# EAGLE design DDC118_eval2_rev1E (EAGLE 7.3.0)
Assembly variants: low-on-parts
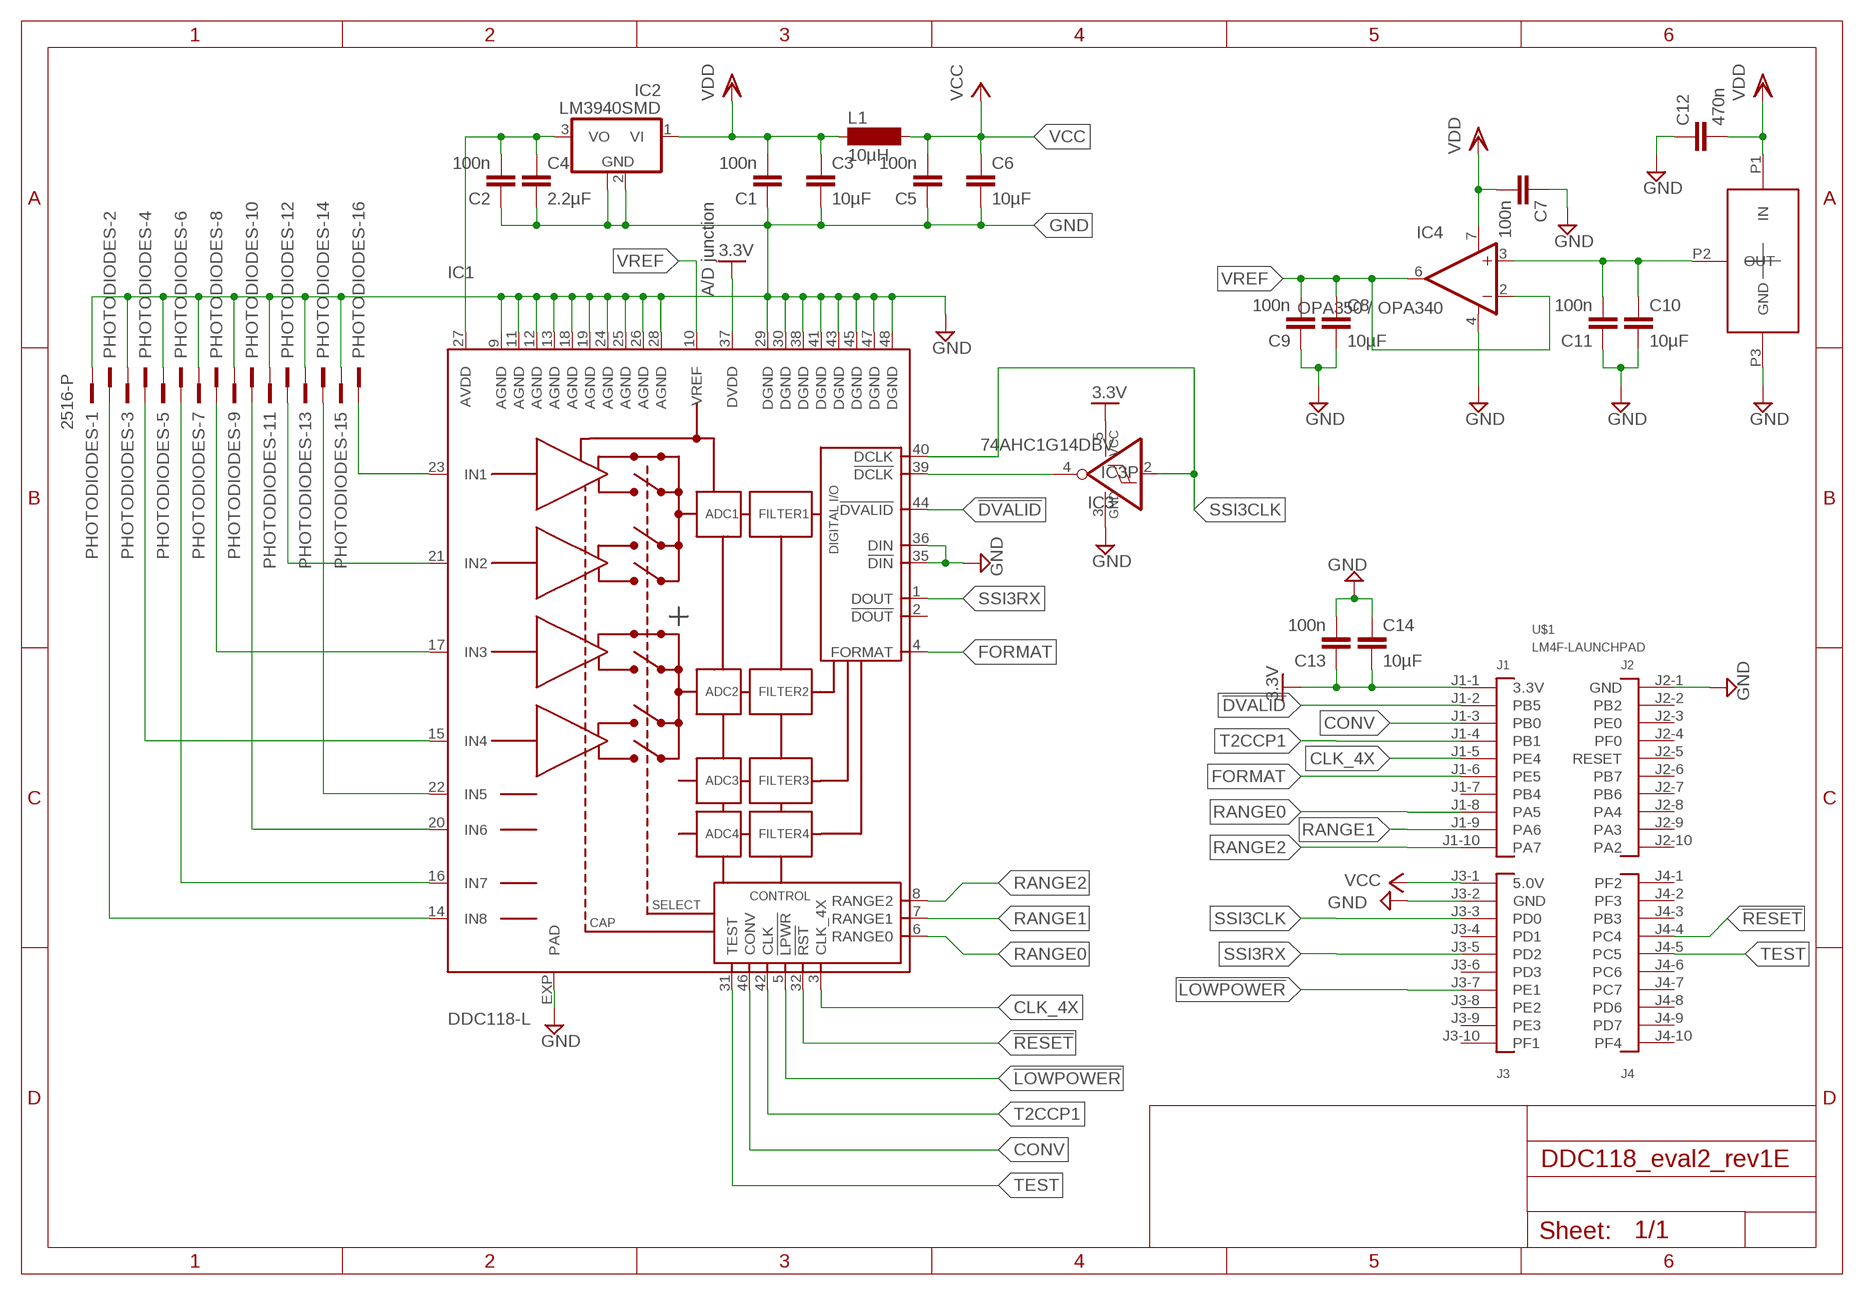
[diagram p0: schematic, sheet 1]

## Parts
C1  100n  C-EUC0805K  [C0805K]  (not fitted in variant low-on-parts)
C2  100n  C-EUC0805K  [C0805K]  (not fitted in variant low-on-parts)
C3  10µF  C-EUC0805  [C0805]
C4  2.2µF  C-EUC0805  [C0805]  (variant low-on-parts: 4µ7)
C5  100n  C-EUC0805K  [C0805K]
C6  10µF  C-EUC0805  [C0805]  (not fitted in variant low-on-parts)
C7  100n  C-EUC0805K  [C0805K]
C8  10µF  C-EUC0805  [C0805]  (variant low-on-parts: 4µ7)
C9  100n  C-EUC0805K  [C0805K]  (not fitted in variant low-on-parts)
C10  10µF  C-EUC0805  [C0805]  (not fitted in variant low-on-parts)
C11  100n  C-EUC0805K  [C0805K]
C12  470n  C-EUC0805K  [C0805K]
C13  100n  C-EUC0805K  [C0805K]  (variant low-on-parts: 470n)
C14  10µF  C-EUC0805  [C0805]  (variant low-on-parts: 4µ7)
IC1  DDC118-L  [VQFN48-L]
IC2  LM3940SMD  [SOT223]
IC3  74AHC1G14DBV  [SOT23-5]
IC4  OPA350 / OPA340  OPA340U  [SO08]
L1  10µH  MS50  [MS50]
PHOTODIODES  2516-P  [PAK100/2500-16-PADS]
U1  REF30XX  [SOT-23]
U$1  LM4F-LAUNCHPAD  [LM4F120-LAUNCHPAD]

## Nets
!DCLK: IC1.39(!DCLK) IC3.4(O)
!DVALID: IC1.44(!DVALID) U$1.J1-2(PB5)
!LOWPOWER: IC1.5(!LPWR) U$1.J3-7(PE1)
!RESET: IC1.32(!RST) U$1.J4-4(PC4)
+3.3V: C13.1 C14.2 IC1.37(DVDD) IC3.5(VCC) U$1.J1-1(3.3V) ; supply symbol labelled 3.3V
AVDD: C2.2 C4.1 IC1.27(AVDD) IC2.3(VO)
CLK_4X: IC1.3(CLK_4X) U$1.J1-5(PE4)
CONV: IC1.46(CONV) U$1.J1-3(PB0)
FORMAT: IC1.4(FORMAT) U$1.J1-6(PE5)
GND: C1.1 C2.1 C3.2 C4.2 C5.1 C6.2 C7.1 C8.2 C9.1 C10.2 C11.1 C12.1 C13.2 C14.1 IC1.9(AGND) IC1.11(AGND) IC1.12(AGND) IC1.13(AGND) IC1.18(AGND) IC1.19(AGND) IC1.24(AGND) IC1.25(AGND) IC1.26(AGND) IC1.28(AGND) IC1.29(DGND) IC1.30(DGND) IC1.35(!DIN) IC1.36(DIN) IC1.38(DGND) IC1.41(DGND) IC1.43(DGND) IC1.45(DGND) IC1.47(DGND) IC1.48(DGND) IC1.EXP(PAD) IC2.2(GND) IC2.4(GND) IC3.3(GND) IC4.4(V-) PHOTODIODES.1 PHOTODIODES.3 PHOTODIODES.5 PHOTODIODES.7 PHOTODIODES.9 PHOTODIODES.11 PHOTODIODES.13 PHOTODIODES.15 U1.P3(GND) U$1.J2-1(GND) U$1.J3-2(GND)
N$2: IC1.21(IN2) PHOTODIODES.12
N$3: IC1.23(IN1) PHOTODIODES.16
N$4: IC1.20(IN6) PHOTODIODES.10
N$5: IC1.17(IN3) PHOTODIODES.8
N$6: IC1.16(IN7) PHOTODIODES.6
N$7: IC1.22(IN5) PHOTODIODES.14
N$8: IC1.15(IN4) PHOTODIODES.4
N$9: IC1.14(IN8) PHOTODIODES.2
N$14: C10.1 C11.2 IC4.3(+IN) U1.P2(OUT)
RANGE0: IC1.6(RANGE0) U$1.J1-8(PA5)
RANGE1: IC1.7(RANGE1) U$1.J1-9(PA6)
RANGE2: IC1.8(RANGE2) U$1.J1-10(PA7)
SSI3CLK: IC1.40(DCLK) IC3.2(I) U$1.J3-3(PD0)
SSI3RX: IC1.1(DOUT) U$1.J3-5(PD2)
T2CCP1: IC1.42(CLK) U$1.J1-4(PB1)
TEST: IC1.31(TEST) U$1.J4-5(PC5)
VCC: C5.2 C6.1 L1.2 U$1.J3-1(5.0V)
VDD: C1.2 C3.1 C7.2 C12.2 IC2.1(VI) IC4.7(V+) L1.1 U1.P1(IN)
VREF: C8.1 C9.2 IC1.10(VREF) IC4.2(-IN) IC4.6(OUT)
Unconnected: IC1.2(!DOUT) U$1.J1-7(PB4) U$1.J2-2(PB2) U$1.J2-3(PE0) U$1.J2-4(PF0) U$1.J2-5(RESET) U$1.J2-6(PB7) U$1.J2-7(PB6) U$1.J2-8(PA4) U$1.J2-9(PA3) U$1.J2-10(PA2) U$1.J3-4(PD1) U$1.J3-6(PD3) U$1.J3-8(PE2) U$1.J3-9(PE3) U$1.J3-10(PF1) U$1.J4-2(PF3) U$1.J4-3(PB3) U$1.J4-6(PC6) U$1.J4-7(PC7) U$1.J4-8(PD6) U$1.J4-9(PD7) U$1.J4-10(PF4)

## Notes on the sheet
- A/D junction

## Power pins joined to a net without a drawn wire
PF2: U$1.J4-1(PF2)

## Library data of the parts
C1-C14 = rcl:C-EU: CAPACITOR, European symbol
IC1 = texas-DAS:DDC118: Octal Current Input, 20-Bit Analog-To-Digital Converter Description: The DDC118 is a 20-bit, octal channel, current-input analog-to-digital (A/D) converter. It combines both current-to-voltage and A/D conversion so that eight low-level current output devices, such as photodiodes, can be directly connected to its inputs and digitized. For each of the eight inputs, the DDC118 provides a dual-switched integrator front-end. This design allows for continuous current integration: while one integrator is being digitized by the onboard A/D converter, the other is integrating the input current. Adjustable full-scale ranges from 12pC to 350pC and adjustable integration times from 50µs to 1s allow currents from fAs to µAs to be measured with outstanding precision. Low-level linearity is ±0.5ppm of the full-scale range and noise is 5.2ppm of the full-scale range. Two modes of operation are provided. In Low-Power mode, total power dissipation is only 13.5mW per channel with a maximum data rate of 2.5kSPS. High-Speed mode supports data rates up to 3.125kSPS with a corresponding dissipation of 18mW per channel. Features: SINGLE-CHIP SOLUTION TO DIRECTLY MEASURE EIGHT LOW-LEVEL CURRENTS HIGH PRECISION, TRUE INTEGRATING FUNCTION INTEGRAL LINEARITY: ±0.01% of Reading ±0.5ppm of FSR VERY LOW NOISE: 5.2ppm of FSR LOW POWER: 13.5mW/channel ADJUSTABLE DATA RATE: Up to 3.125kSPS PROGRAMMABLE FULL SCALE DAISY-CHAINABLE SERIAL INTERFACE Datasheet: http://www.ti.com/lit/ds/symlink/ddc118.pdf Additional information: Basics of operation can be found in the DDC112 datasheet: http://www.ti.com/lit/ds/symlink/ddc112.pdf For practical daisychaining and layout considerations, consider the DDC112 evaluation board documentation: http://www.ti.com/lit/an/sbaa029/sbaa029.pdf
IC2 = custom-parts:LM3940SMD: LM3940 1A Low Dropout Regulator for 5V to 3.3V Conversion http://www.ti.com/lit/ds/symlink/lm3940.pdf The LM3940 is a 1A low dropout regulator designed to provide 3.3V from a 5V supply. The LM3940 is ideally suited for systems which contain both 5V and 3.3V logic, with prime power provided from a 5V bus. Because the LM3940 is a true low dropout regulator, it can hold its 3.3V output in regulation with input voltages as low as 4.5V. The T0-220 package of the LM3940 means that in most ap- plications the full 1A of load current can be delivered without using an additional heatsink. The surface mount TO-263 package uses minimum board space, and gives excellent power dissipation capability when soldered to a copper plane on the PC board.
IC3 = 74xx-little-de:74*1G14: Single Schmitt-Trigger Inverter Gate
IC4 = burr-brown:OPA340: Rail-to-Rail Operational Amplifiers Single-Supply, MicroAmplifier(TM) Series; MPN: OPA340UA; OC_FARNELL: 1106196; OC_NEWARK: 24M5449
L1 = inductor-neosid:MS50: INDUCTOR SMD power inductor; OC_FARNELL: unknown; OC_NEWARK: unknown
PHOTODIODES = custom-conn:2516-: 3M (TM) Pak 100 4-Wall Header 2x8 Pins Source: 3M
U1 = custom-parts:REF30XX: CMOS VOLTAGE REFERENCE: 50ppm/°C, 50µA in SOT23-3 Description: The REF30xx is a precision, low power, low voltage dropout voltage reference family available in a tiny SOT23-3. The REF30xx?s small size and low power consumption (50µA max) make it ideal for portable and battery-powered applications. The REF30xx does not require a load capacitor, but is stable with any capacitive load. Unloaded, the REF30xx can be operated with supplies within 1mV of output voltage. All models are specified for the wide temperature range, ?40°C to +125°C. Features: MicroSIZE PACKAGE: SOT23-3 LOW DROPOUT: 1mV HIGH OUTPUT CURRENT: 25mA LOW TEMPERATURE DRIFT: 50ppm/°C max HIGH ACCURACY: 0.2% LOW IQ: 50µA max Datasheet: http://www.ti.com/lit/ds/sbvs032f/sbvs032f.pdf
U$1 = texas-LM4F-Launchpad:LM4F-LAUNCHPAD: Stellaris® LM4F120 LaunchPad - BoosterPack Footprint Description: The Stellaris® LM4F120 LaunchPad Evaluation Board (EK-LM4F120XL) is a low-cost evaluation platform for ARM® Cortex?-M4F-based microcontrollers. This is the 4x 10 pin main header to which add-on PCBs or mainbaords can connect. Additional Information: http://www.ti.com/lit/ug/spmu289a/spmu289a.pdf

## Net classes
0 default: width 0.15 mm, drill 0.3 mm, clearance 0.15 mm

## Board
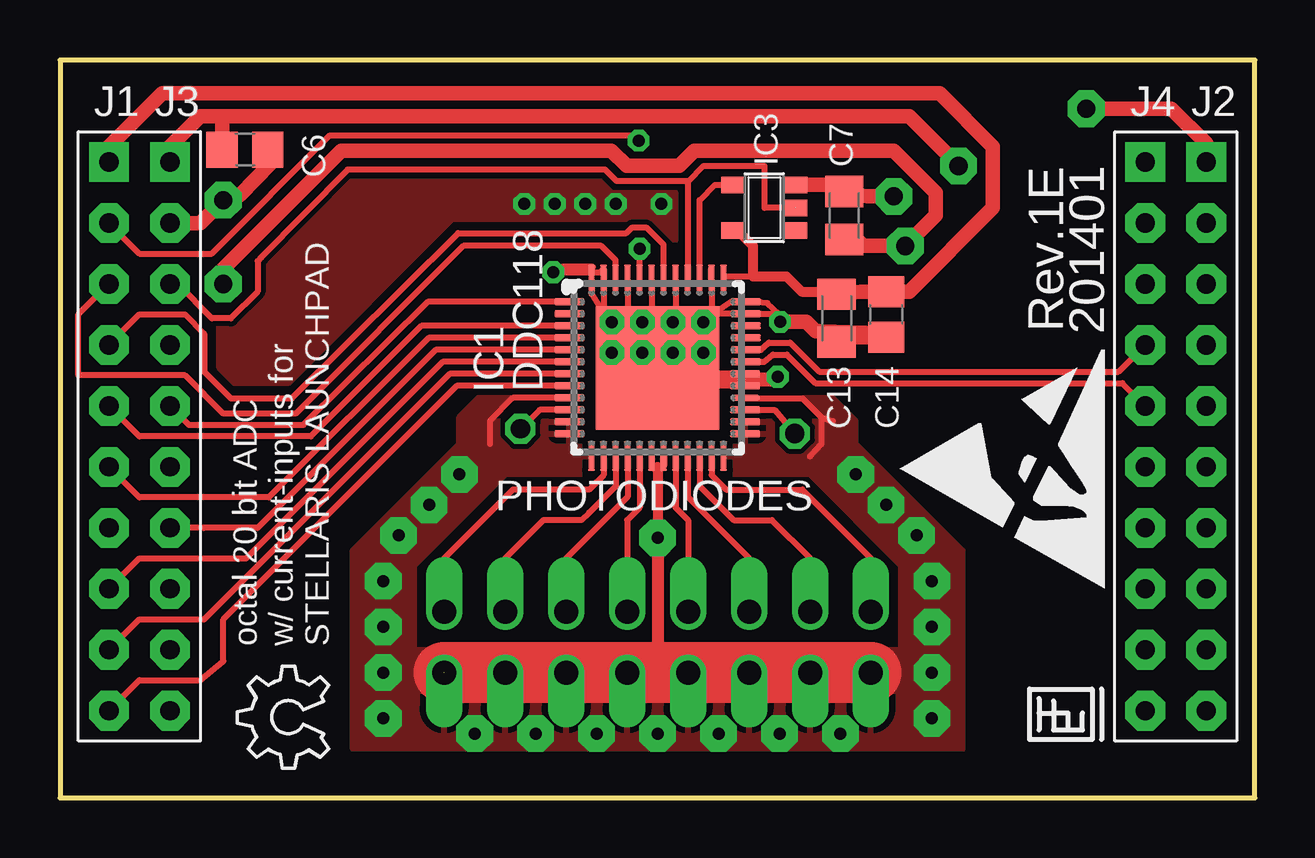
[diagram p1: board, top side]
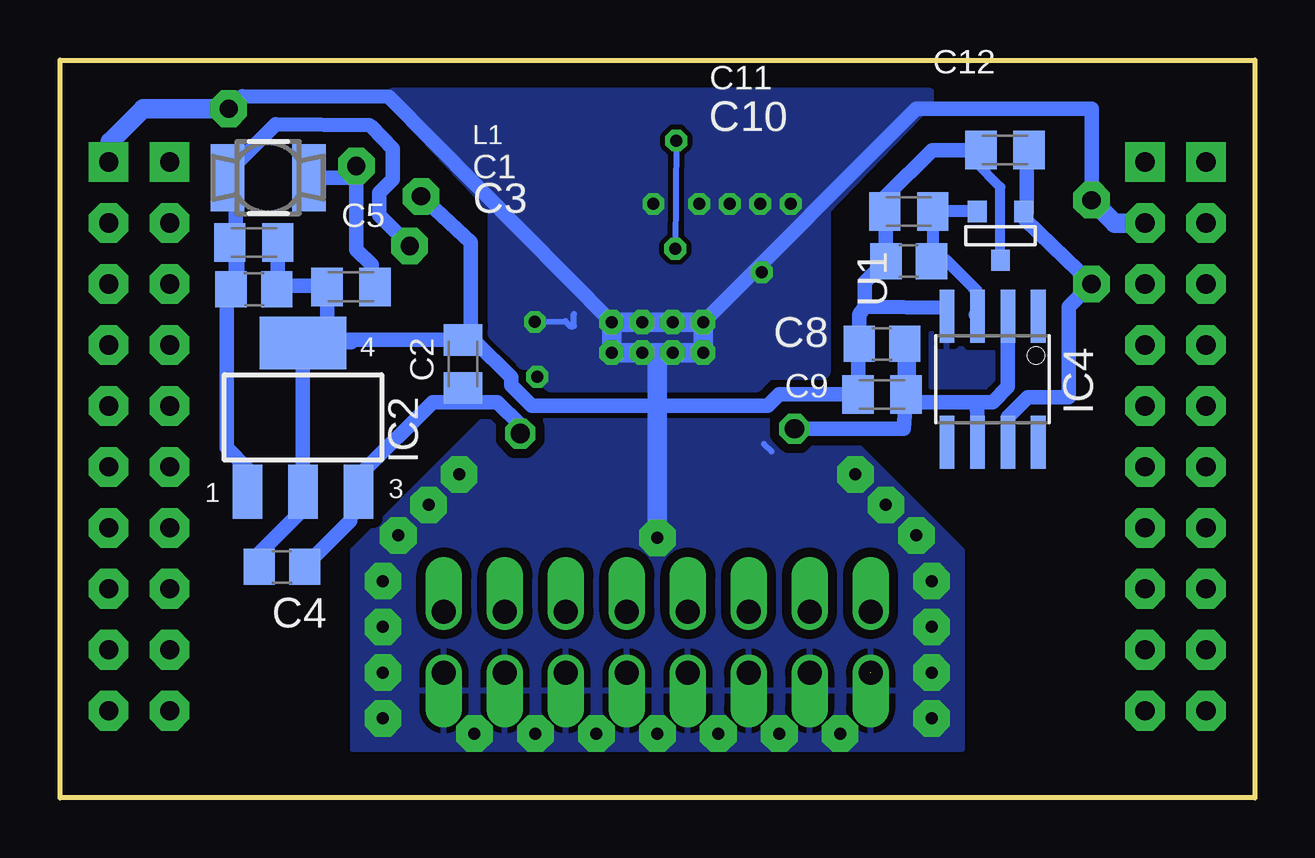
[diagram p2: board, bottom side, seen from below]

Size 49.79 x 30.74 mm. Coordinates in mm from the lower left corner, seen from the top.
Outline: 0,0 49.79,0 49.79,30.74 0,30.74 0,0
Copper layers (1*16): Top 0.035mm / dielectric 1.5mm / Bottom 0.035mm
Design rules "default *": minimum track width 10mil, minimum drill 0.4mm, track to track 8mil, track to pad 8mil, pad to pad 8mil, via to via 8mil, smd to smd 8mil, copper to edge 40mil, drill to drill 8mil, minimum pad ring 10mil, minimum via ring 8mil, stop-mask expansion 0.015mm, vias tented up to drill 0.3mm, thermal gap 10mil

### Footprints (pad centres in the part's own frame; a part is rotated, then mirrored left to right if it is on the bottom)
C0805K = smd 1.3 x 1.6: 1 -1,0; 2 1,0
C0805 = smd 1.3 x 1.5: 1 -0.95,0; 2 0.95,0
VQFN48-L = smd 1.25 x 0.28: 1 -3.675,2.75; 2 -3.675,2.25; 3 -3.675,1.75; 4 -3.675,1.25; 5 -3.675,0.75; 6 -3.675,0.25; 7 -3.675,-0.25; 8 -3.675,-0.75; 9 -3.675,-1.25; 10 -3.675,-1.75; 11 -3.675,-2.25; 12 -3.675,-2.75; 25 3.65,-2.75; 26 3.65,-2.25; 27 3.65,-1.75; 28 3.65,-1.25; 29 3.65,-0.75; 30 3.65,-0.25; 31 3.675,0.25; 32 3.675,0.75; 33 3.675,1.25; 34 3.675,1.75; 35 3.675,2.25; 36 3.675,2.75 | smd 0.28 x 1.25: 13 -2.75,-3.675; 14 -2.25,-3.675; 15 -1.75,-3.675; 16 -1.25,-3.675; 17 -0.75,-3.675; 18 -0.25,-3.675; 19 0.25,-3.675; 20 0.75,-3.675; 21 1.25,-3.675; 22 1.75,-3.675; 23 2.25,-3.675; 24 2.75,-3.675; 37 2.75,3.675; 38 2.25,3.675; 39 1.75,3.675; 40 1.25,3.675; 41 0.75,3.675; 42 0.25,3.675; 43 -0.25,3.675; 44 -0.75,3.675; 45 -1.25,3.675; 46 -1.75,3.675; 47 -2.25,3.675; 48 -2.75,3.675 | smd 5.15 x 5.15: EXP 0,0
SOT223 = smd 1.219 x 2.235: 1 -2.311,-3.099; 2 0,-3.099; 3 2.311,-3.099 | smd 3.6 x 2.2: 4 0,3.099
SOT23-5 = smd 0.69 x 0.99: 1 -0.95,-1.29; 2 0,-1.29; 3 0.95,-1.29; 4 0.95,1.3; 5 -0.95,1.3
SO08 = smd 0.61 x 2.21: 1 -1.905,-2.616; 2 -0.635,-2.616; 3 0.635,-2.616; 4 1.905,-2.616; 5 1.905,2.616; 6 0.635,2.616; 7 -0.635,2.616; 8 -1.905,2.616
MS50 = smd 2.8 x 1.4: 1 0,-1.7; 2 0,1.7
PAK100/2500-16-PADS = drill 1 pad 1.524 offset: 1 -8.89,-1.27; 2 -8.89,1.27; 3 -6.35,-1.27; 4 -6.35,1.27; 5 -3.81,-1.27; 6 -3.81,1.27; 7 -1.27,-1.27; 8 -1.27,1.27; 9 1.27,-1.27; 10 1.27,1.27; 11 3.81,-1.27; 12 3.81,1.27; 13 6.35,-1.27; 14 6.35,1.27; 15 8.89,-1.27; 16 8.89,1.27
SOT-23 = smd 0.787 x 0.889: P1 -0.991,-1.016; P2 0.94,-1.016; P3 -0.025,1.016
LM4F120-LAUNCHPAD = drill 0.8 pad 1.651 square: J1-1 2.54,35.56; J2-1 48.26,35.56; J3-1 5.08,35.56; J4-1 45.72,35.56 | drill 0.8 pad 1.651 octagon: J1-2 2.54,33.02; J1-3 2.54,30.48; J1-4 2.54,27.94; J1-5 2.54,25.4; J1-6 2.54,22.86; J1-7 2.54,20.32; J1-8 2.54,17.78; J1-9 2.54,15.24; J1-10 2.54,12.7; J2-2 48.26,33.02; J2-3 48.26,30.48; J2-4 48.26,27.94; J2-5 48.26,25.4; J2-6 48.26,22.86; J2-7 48.26,20.32; J2-8 48.26,17.78; J2-9 48.26,15.24; J2-10 48.26,12.7; J3-2 5.08,33.02; J3-3 5.08,30.48; J3-4 5.08,27.94; J3-5 5.08,25.4; J3-6 5.08,22.86; J3-7 5.08,20.32; J3-8 5.08,17.78; J3-9 5.08,15.24; J3-10 5.08,12.7; J4-2 45.72,33.02; J4-3 45.72,30.48; J4-4 45.72,27.94; J4-5 45.72,25.4; J4-6 45.72,22.86; J4-7 45.72,20.32; J4-8 45.72,17.78; J4-9 45.72,15.24; J4-10 45.72,12.7

### Placement (x,y rotation side)
C1  41.71,23.14 180 bottom
C2  33,18.07 270 bottom
C3  41.71,21.19 0 bottom
C4  40.53,9.62 180 bottom
C5  37.66,21.29 0 bottom
C6  7.7,27.01 0 top
C7  32.68,24.27 270 top
C8  15.53,18.91 180 bottom
C9  15.53,16.8 0 bottom
C10  14.42,22.36 180 bottom
C11  14.42,24.42 0 bottom
C12  10.41,26.99 0 bottom
C13  32.36,19.98 270 top
C14  34.42,20.14 90 top
IC1  24.9,17.91 0 top
IC2  39.66,15.85 0 bottom
IC3  29.34,24.58 90 top
IC4  10.93,17.44 180 bottom
L1  41.12,25.84 270 bottom
PHOTODIODES  24.9,6.48 0 top
U1  10.63,23.41 180 bottom
U$1  -0.5,-9.07 0 top
U$2  [OSHW_6X150_NOTEXT]  11.2,1.23 90 top
U$3  [ESD_10.00]  43.6,8.63 90 top

### Tracks (layer width: path | path; a pad name or v marks a point on that pad's centre or on a via)
!DCLK
  Top 0.254: IC1.39 26.65,22.2 26.65,24.9 27.28,25.54 IC3.4
!DVALID  (via drill 0.5 pad 0.76)
  Top 0.254: IC1.44 v24.15,22.88 | U$1.J1-2 3.31,22.68 6.33,22.68 11.25,27.6 23.79,27.6 v24.11,27.38
  Bottom 0.254: v24.11,27.38 v24.15,22.88
!LOWPOWER
  Top 0.254: IC1.5 15.65,18.67 8.23,11.25 6.01,11.25 5.85,11.25 U$1.J3-7
!RESET
  Top 0.254: IC1.32 29.2,18.67 29.54,18.97 30.42,18.97 31.63,17.76 44.11,17.76 U$1.J4-4
+3.3V
  Top 0.254: IC1.37 27.65,21.72 28.07,21.72 28.87,21.72 30.27,21.73
  Top 0.406: C13.1 31.84,21.09 30.9,21.09 30.27,21.73 28.87,21.72 28.87,23 28.23,23.63 IC3.5
  Top 0.61: U$1.J1-1 2.04,27.12 4.26,29.34 36.65,29.34 38.87,27.12 38.87,24.58 35.38,21.09 33.48,21.09 C14.2 33.36,21.09 C13.1
AVDD  (via drill 0.8 pad 1.25)
  Top 0.254: IC1.27 29.78,16.17 v30.61,15.17
  Bottom 0.61: v30.61,15.17 30.61,15.53 31.57,16.49 32.88,16.49 | 32.88,16.49 C2.2 | C4.1 39.92,9.32 37.7,11.54 37.6,12.5 IC2.3 37.28,12.82 37.28,13.47 34.27,16.49 32.88,16.49
CLK_4X
  Top 0.254: IC1.3 15.06,19.67 10.45,15.06 3.31,15.06 U$1.J1-5
CONV
  Top 0.254: IC1.46 23.15,22.4 22.56,23 16.8,23 9.82,16.01 6.8,16.01 5.21,17.6 0.77,17.6 0.77,20.14 U$1.J1-3
FORMAT
  Top 0.254: IC1.4 15.36,19.17 8.71,12.52 3.31,12.52 U$1.J1-6
GND  (via drill 0.5 pad 0.76, 0.5 pad 1.02, 0.5 pad 1.52, 0.76 pad 1.52)  (1 unrouted)
  Top 0.254: IC1.18 24.65,13.79 24.9,13.79 | IC1.47 22.65,20.17 22.68,20.14 | IC1.48 22.15,20.98 22.68,20.14 | 22.68,20.14 v23,19.82 | v23,19.82 23.31,19.5 | 23.31,19.5 v24.27,18.55 IC1.EXP | IC1.45 23.65,19.84 | 23.65,19.84 23.31,19.5 | IC1.43 24.65,20.2 | 24.65,20.2 v24.27,19.82 23.67,19.82 23.65,19.84 | IC1.41 25.65,20.25 | 25.65,20.25 25.54,20.14 | 25.54,20.14 24.72,20.14 24.65,20.2 | 27.15,20.17 IC1.38 27.15,21.54 27.12,21.57 | 27.15,20.17 26.96,19.98 | 26.96,19.98 v26.8,19.82 26.08,19.82 25.65,20.25 | 27.15,20.17 IC1.35 29.61,20.17 v30,19.83 29.98,20.14 29.47,20.61 28.82,20.67 IC1.36 27.97,20.67 26.96,19.98 | IC1.30 26.74,17.67 | 26.49,17.6 26.55,17.67 26.74,17.67 | 26.49,17.6 25.22,17.6 IC1.EXP | IC1.29 26.92,17.17 26.8,17.28 | 26.8,17.28 26.49,17.6 | 26.79,16.67 26.49,16.96 26.49,17.6 | 26.74,17.67 26.8,17.6 | 26.8,17.6 26.8,17.28 | 26.8,17.28 25.54,17.28 v25.54,18.55 | IC1.EXP 24.27,17.28 | v23,18.55 v23,19.82 | v26.8,18.55 26.8,17.6 | v25.54,19.82 25.54,20.14 | 32.57,25.53 C7.1 33.27,25.11 | IC1.9 18.87,16.67 17.91,15.69 17.91,14.74 | 31.73,15.85 31.73,14.74 31.25,14.22 | 31.73,15.85 32.2,15.69 | IC1.28 28.37,16.65 30.93,16.65 31.73,15.85 | 22.65,21.57 22.65,22.04 22.52,21.9 v20.55,21.9 20.93,22.13 22.2,22.13 | PHOTODIODES.3 19.18,5.21 | 23.31,5.21 PHOTODIODES.7 | 27.12,22.04 27.12,21.57 | 27.12,21.57 27.12,21.41
  Top 0.305: IC1.19 25.15,13.88 24.9,13.63
  Top 0.406: 24.9,13.79 24.9,13.63 v24.9,10.83
  Top 0.5: v24.9,10.83 24.9,5.21
  Top 0.61: 32.57,25.53 IC3.3 30.77,25.53 | C6.2 8.76,26.41 7.5,25.13 7.43,25.06 6.96,25.06 6.8,25.38 v6.8,24.9 5.85,23.95 U$1.J3-2 | U$1.J2-1 47.76,27.27 46.3,28.71 v42.76,28.71 | 33.27,25.11 33.63,25.06 v34.74,25.06 | C13.2 32.73,19.19 C14.1 34.27,19.19 34.27,19.35 31.7,19.45 31.48,19.45 31.1,19.83 v30,19.83 | v29.9,17.54 30,17.53 29.9,17.43 27.12,17.44
  Top 2.54: PHOTODIODES.1 PHOTODIODES.15
  Bottom 0.254: 20.45,14.74 20.14,14.42 | v30,19.83 28.73,19.86 28.5,19.63 28.38,19.66 28.38,20.17
  Bottom 0.406: U1.P3 10.6,25.44 11.63,26.47
  Bottom 0.508: IC4.4 12.84,20.36 12.9,20.43
  Bottom 0.61: v6.8,24.9 6.8,28.71 14.11,28.71 v23,19.82 | v42.76,28.71 42.2,29.23 36.09,29.21 v26.8,19.82 | 32.68,19.03 32.68,23.15 v34.74,25.06 | 32.68,19.03 32.5,19.03 30.99,17.52 30.99,17.18 30.87,17.08 30.12,16.33 24.9,16.33 20.3,16.33 19.82,16.8 17.12,16.8 16.8,16.65 16.69,16.65 C9.1 16.53,18.66 C8.2 16.49,18.71 16.49,20.12 16.25,20.45 | 38.08,19.07 C2.1 32.63,18.71 32.68,19.03 | 38.08,19.07 38.71,19.07 | 38.71,19.07 39.54,19.07 IC2.4 IC2.2 39.76,11.92 41.83,9.85 41.73,9.97 C4.2 | 37.65,18.98 37.98,18.98 38.08,19.07 | C1.1 40.71,21.14 C3.2 40.6,21.33 38.9,21.33 C5.1 38.66,19.12 38.71,19.07 | 12.9,20.43 16.25,20.45 | 16.25,20.45 16.25,21.48 C10.2 15.37,24.37 C11.1 15.38,24.47 15.38,25.06 13.45,26.99 C12.1 11.63,26.47
  Bottom 0.813: v24.9,10.83 24.9,16.33 24.9,18.55 | 24.9,18.55 v25.54,18.55 v26.8,18.55 v26.8,19.82 v25.54,19.82 v24.27,19.82 v23,19.82 v23,18.55 v24.27,18.55 24.9,18.55 | v6.8,24.9 5.85,23.95 U$1.J3-2 | U$1.J2-1 47.7,27.33 46.32,28.71 v42.76,28.71
  other vias: 33.16,13.47 34.42,12.2 35.7,10.93 36.33,9.03 36.33,7.12 36.33,5.21 36.33,3.31 32.52,2.68 29.98,2.68 27.44,2.68 24.9,2.68 22.36,2.68 19.82,2.68 17.28,2.68 16.64,13.47 15.38,12.2 14.11,10.93 13.47,9.03 13.47,7.12 13.47,5.21 13.47,3.31 19.34,24.74 20.61,24.74 21.88,24.74 23.15,24.74 25.06,24.74
  pour Top: 17.6,15.69 21.73,15.69 21.73,14.74 22.04,14.74 22.04,13.79 21.73,13.47 18.55,13.47 14.74,9.66 14.74,6.17 35.06,6.17 35.06,9.66 31.25,13.47 28.07,13.47 27.76,13.79 27.76,14.74 28.07,14.74 28.07,15.69 32.2,15.69 37.6,10.29 37.6,2.04 12.2,2.04 12.2,10.29
  pour Bottom (isolate 0.381): 17.6,15.69 32.2,15.69 37.6,10.29 37.6,2.04 12.2,2.04 12.2,10.29
  pour Bottom: 18.07,24.58 18.07,17.81 20.3,17.81 20.81,17.3 29.3,17.3 30.14,18.23 30.41,18.23 30.41,18.24 30.9,18.73 31.57,19.38 31.57,24.58 35.85,29.19 13.63,29.19
  pour Top: 17.91,15.69 17.6,15.69 16.64,14.74 16.64,15.85 17.44,16.66 18.87,16.66
  pour Top: 30.93,16.65 31.73,15.85 31.73,14.74 33.16,14.74 33.16,15.69 32.2,16.65
  pour Bottom: 13.15,19.66 12.52,19.66 12.36,19.5 12.36,18.87 12.04,18.55 10.93,18.55 10.93,17.44 11.25,17.12 13.47,17.12 13.47,19.34
  pour Top (isolate 0.203): 12.1,25.69 22.5,25.69 22.97,25.22 25.64,25.22 25.64,23.21 24.74,24.11 16.33,24.11 9.5,17.28 7.28,17.28 6.64,17.91 6.64,20.14
N$2
  Top 0.254: IC1.21 26.15,12.54 28.71,9.98 PHOTODIODES.12
N$3
  Top 0.254: IC1.23 27.15,13.44 27.76,12.83 30.93,12.83 33.79,9.98 PHOTODIODES.16
N$4
  Top 0.254: IC1.20 25.65,12.08 26.17,11.56 PHOTODIODES.10
N$5
  Top 0.254: IC1.17 24.15,12.08 23.63,11.56 PHOTODIODES.8
N$6
  Top 0.254: IC1.16 23.65,12.54 21.09,9.98 PHOTODIODES.6
N$7
  Top 0.254: IC1.22 26.65,12.99 28.07,11.56 29.66,11.56 31.25,9.98 PHOTODIODES.14
N$8
  Top 0.254: IC1.15 23.15,12.99 22.04,11.88 21.73,11.56 20.14,11.56 18.55,9.98 18.55,8.71 PHOTODIODES.4
N$9
  Top 0.254: IC1.14 22.65,13.44 22.36,13.15 22.04,12.83 18.87,12.83 16.01,9.98 PHOTODIODES.2
N$14
  Bottom 0.508: U1.P2 C11.2 13.42,22.41 | 13.42,22.41 C10.1 | 13.42,22.41 12.88,22.41 11.7,21.23 11.6,21.13 11.6,20.09 IC4.3
  Bottom 0.61: 13.42,22.41 C10.1 | 11.63,20.12 IC4.3
RANGE0
  Top 0.254: IC1.6 15.94,18.17 7.76,9.98 6.01,9.98 5.85,9.98 3.31,9.98 U$1.J1-8
RANGE1
  Top 0.254: IC1.7 16.24,17.67 9.5,10.93 | 9.5,10.93 9.34,10.77 9.5,10.93 | U$1.J1-9 3.31,7.44 6.01,7.44 9.5,10.93
RANGE2
  Top 0.254: IC1.8 16.53,17.17 6.8,7.44 6.8,5.69 5.85,4.9 3.31,4.9 U$1.J1-10
SSI3CLK
  Top 0.254: IC1.40 26.17,21.41 26.17,25.69 | 26.17,25.69 23.19,25.69 22.71,26.17 11.98,26.17 8.39,22.52 8.23,22.36 8.23,21.09 7.12,19.98 6.33,19.98 4.9,21.41 U$1.J3-3 | IC3.2 29.34,24.58 29.34,26.33 26.8,26.33 26.17,25.69
SSI3RX
  Top 0.254: U$1.J3-5 5.37,15.53 10.14,15.53 15.32,20.67 IC1.1
T2CCP1
  Top 0.254: U$1.J1-4 3.31,20.14 5.21,20.14 6.01,19.34 6.01,17.76 7.12,16.65 9.66,16.65 16.59,23.53 23.6,23.53 23.84,23.77 24.42,23.77 25.15,23.04 IC1.42
TEST
  Top 0.254: IC1.31 29.34,18.17 29.7,18.47 30.29,18.47 31.47,17.28 44.27,17.28 U$1.J4-5
VCC  (via drill 0.76 pad 1.52)
  Top 0.61: U$1.J3-1 4.58,27.12 5.85,28.39 | 5.85,28.39 6.75,28.39 | 6.75,28.39 C6.1 | 5.85,28.39 6.75,28.39 | 6.75,28.39 35.38,28.39 v37.44,26.33
  Bottom 0.61: v37.44,26.33 37.44,25.69 | 37.44,25.69 37.44,22.84 36.81,22.2 36.81,21.14 C5.2 | L1.2 37.5,25.83 37.44,25.69
VDD  (via drill 0.76 pad 1.52)
  Top 0.254: 32.63,23.11 C7.2 32.84,23.31 33,23.31
  Top 0.61: 33,23.31 33.16,23.31 33.47,23 v35.22,23 36.49,24.26 36.49,25.22 34.74,26.96 26.43,26.96 25.79,26.33 23.61,26.33 22.97,26.96 11.72,26.96 6.8,22.04 v6.8,21.41
  Bottom 0.61: IC2.1 41.98,13.72 42.84,14.58 42.84,20.61 C3.1 42.41,21.14 42.41,22.36 | 42.41,22.36 C1.2 | 42.46,22.31 42.46,25.87 L1.1 42.32,26.53 40.79,28.06 36.9,28.03 36.81,27.96 35.93,27.04 35.93,25.77 36.49,25.22 36.49,24.26 v35.22,23 | 42.46,21.77 42.46,22.31 | 42.46,22.31 42.41,22.36 | IC4.7 10.29,15.85 9.46,16.69 7.76,16.69 7.76,20.45 v6.8,21.41 9.57,24.08 U1.P1 9.5,24.37 9.5,26.49 C12.2
VREF  (via drill 0.8 pad 1.25)
  Top 0.254: IC1.10 19.98,16.17 v19.18,15.38
  Bottom 0.61: v19.18,15.38 14.63,15.38 C9.2 | C8.1 14.58,16.85 C9.2 | C9.2 14.53,17.96 14.42,18.07 14.42,16.49 11.64,16.49 | 11.64,16.49 11.56,16.17 IC4.6 | IC4.2 10.29,17.12 10.93,16.49 11.11,16.49 11.64,16.49

### Text on the board
tPlace: Rev.1E | 201401 | DDC118 | octal 20 bit ADC / w/ current-inputs for / STELLARIS LAUNCHPAD